# EAGLE schematic eagle_schematic (EAGLE 8.0.1)
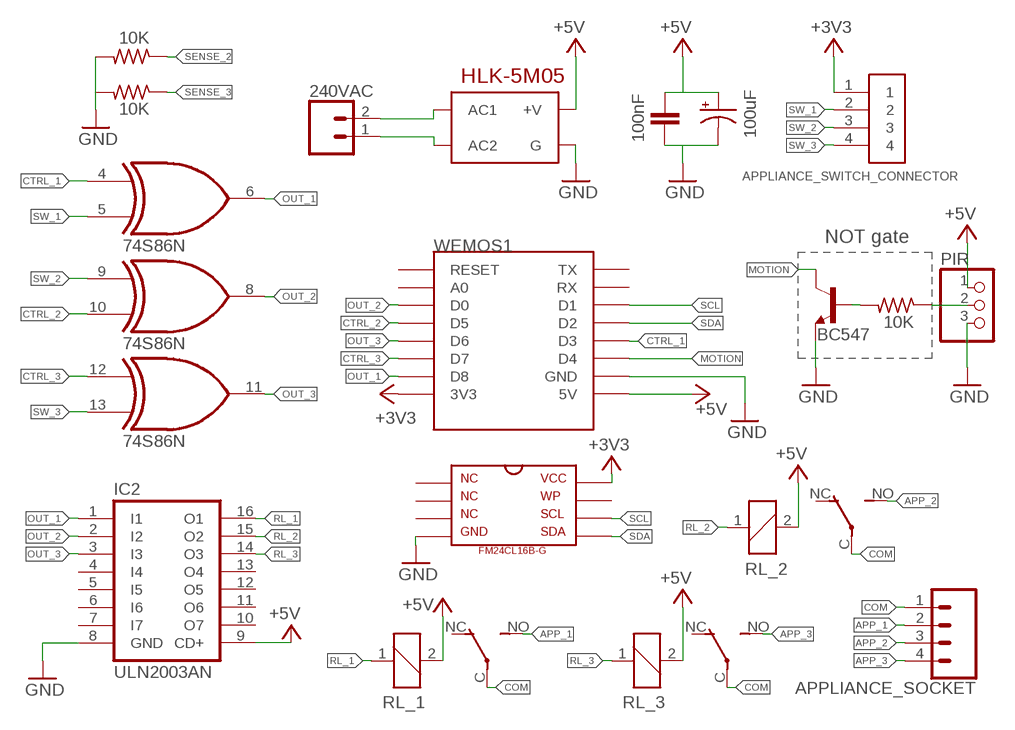
[diagram p0: schematic, sheet 1]

## Parts
240VAC  CONN_025MM  [SCREWTERMINAL-5MM-2]
APPLIANCE_SOCKET  CONN_04SCREW_LOCK  [SCREWTERMINAL-3.5MM-4_LOCK]
APPLIANCE_SWITCH_CONNECTOR  1X4-BIG  [1X04-BIG]
C1  100nF  C5/2.5  [C5B2.5]
C2  100uF  CPOL-USB45181B  [B45181B]
IC1  74S86N  [DIL14]
IC2  ULN2003AN  [DIL16]
PIR  PINHD-1X3CB  [1X03-CLEANBIG]
R1  10K  R-US_0204/7  [0204/7]
R2  10K  R-US_0204/7  [0204/7]
R3  10K  R-US_0204/7  [0204/7]
RL_1  CQ1-12V  [CQ1]
RL_2  CQ1-12V  [CQ1]
RL_3  CQ1-12V  [CQ1]
T1  BC547  [TO92]
U$1  HLK-5M05  [HLK-5M05]
U$3  FM24CL16B-G  [FM24CL16B-G]
WEMOS1  WEMOS-D1-MINI  [WEMOS-D1-MINI]

## Nets
+3V3: APPLIANCE_SWITCH_CONNECTOR.1 U$3.8 WEMOS1.3V3
+5V: C1.1 C2.+ IC2.9(CD+) PIR.1 RL_1.2 RL_2.2 RL_3.2 U$1.+V WEMOS1.5V
APP_1: APPLIANCE_SOCKET.2 RL_1.NO(2:S)
APP_2: APPLIANCE_SOCKET.3 RL_2.NO(2:S)
APP_3: APPLIANCE_SOCKET.4 RL_3.NO(2:S)
COM: APPLIANCE_SOCKET.1 RL_1.C(2:P) RL_2.C(2:P) RL_3.C(2:P)
CTRL_1: IC1.4(B:I0) WEMOS1.D3
CTRL_2: IC1.10(C:I1) WEMOS1.D5
CTRL_3: IC1.12(D:I0) WEMOS1.D7
GND: C1.2 C2.- IC2.8(GND) PIR.3 R2.2 R3.2 T1.1(E) U$1.G U$3.4 WEMOS1.GND
MOTION: T1.3(C) WEMOS1.D4
N$1: R1.2 T1.2(B)
N$2: PIR.2 R1.1
N$3: 240VAC.2 U$1.AC1
N$4: 240VAC.1 U$1.AC2
OUT_1: IC1.6(B:O) IC2.1(I1) WEMOS1.D8
OUT_2: IC1.8(C:O) IC2.2(I2) WEMOS1.D0
OUT_3: IC1.11(D:O) IC2.3(I3) WEMOS1.D6
RL_1: IC2.16(O1) RL_1.1
RL_2: IC2.15(O2) RL_2.1
RL_3: IC2.14(O3) RL_3.1
SCL: U$3.6 WEMOS1.D1
SDA: U$3.5 WEMOS1.D2
SENSE_2: R2.1
SENSE_3: R3.1
SW_1: APPLIANCE_SWITCH_CONNECTOR.2 IC1.5(B:I1)
SW_2: APPLIANCE_SWITCH_CONNECTOR.3 IC1.9(C:I0)
SW_3: APPLIANCE_SWITCH_CONNECTOR.4 IC1.13(D:I1)
Unconnected: IC1.1(A:I0) IC1.2(A:I1) IC1.3(A:O) IC2.4(I4) IC2.5(I5) IC2.6(I6) IC2.7(I7) IC2.10(O7) IC2.11(O6) IC2.12(O5) IC2.13(O4) RL_1.NC(2:O) RL_2.NC(2:O) RL_3.NC(2:O) U$3.1 U$3.2 U$3.3 U$3.7 WEMOS1.A0 WEMOS1.RESET WEMOS1.RX WEMOS1.TX

## Notes on the sheet
- NOT gate

## Power pins joined to a net without a drawn wire
GND: IC1.7(P:GND)
VCC: IC1.14(P:VCC)

## Library data of the parts
240VAC = SparkFun-Retired:CONN_02: Multi connection point. Often used as Generic Header-pin footprint for 0.1 inch spaced/style header connections On any of the 0.1 inch spaced packages, you can populate with these: Break Away Headers - Straight <https://www.sparkfun.com/products/116> (PRT-00116) Break Away Male Headers - Right Angle <https://www.sparkfun.com/products/553> (PRT-00553) Female Headers <https://www.sparkfun.com/products/115> (PRT-00115) Break Away Headers - Machine Pin <https://www.sparkfun.com/products/117> (PRT-00117) Break Away Female Headers - Swiss Machine Pin <https://www.sparkfun.com/products/743> (PRT-00743) For SCREWTERMINALS and SPRING TERMINALS visit here: Screw Terimnals on SparkFun.com <https://www.sparkfun.com/search/results?term=Screw+Terminals> (5mm/3.5mm/2.54mm spacing) This device is also useful as a general connection point to wire up your design to another part of your project. Our various solder wires solder well into these plated through hole pads. Hook-Up Wire - Assortment (Stranded, 22 AWG) <https://www.sparkfun.com/products/11375> (PRT-11375) Hook-Up Wire - Assortment (Solid Core, 22 AWG) <https://www.sparkfun.com/products/11367> (PRT-11367) View the entire wire category on our website here <https://www.sparkfun.com/categories/141> Special notes: Molex polarized connector foot print use with: PRT-08233 with associated crimp pins and housings. 2.54_SCREWTERM for use with PRT-10571. 3.5mm Screw Terminal footprints for PRT-08084 5mm Screw Terminal footprints for use with PRT-08432; SF_SKU: PRT-08432
APPLIANCE_SOCKET = SparkFun-Connectors:CONN_04: Multi connection point. Often used as Generic Header-pin footprint for 0.1 inch spaced/style header connections On any of the 0.1 inch spaced packages, you can populate with these: Break Away Headers - Straight <https://www.sparkfun.com/products/116> (PRT-00116) Break Away Male Headers - Right Angle <https://www.sparkfun.com/products/553> (PRT-00553) Female Headers <https://www.sparkfun.com/products/115> (PRT-00115) Break Away Headers - Machine Pin <https://www.sparkfun.com/products/117> (PRT-00117) Break Away Female Headers - Swiss Machine Pin <https://www.sparkfun.com/products/743> (PRT-00743) For SCREWTERMINALS and SPRING TERMINALS visit here: Screw Terimnals on SparkFun.com <https://www.sparkfun.com/search/results?term=Screw+Terminals> (5mm/3.5mm/2.54mm spacing) This device is also useful as a general connection point to wire up your design to another part of your project. Our various solder wires solder well into these plated through hole pads. Hook-Up Wire - Assortment (Stranded, 22 AWG) <https://www.sparkfun.com/products/11375> (PRT-11375) Hook-Up Wire - Assortment (Solid Core, 22 AWG) <https://www.sparkfun.com/products/11367> (PRT-11367) View the entire wire category on our website here <https://www.sparkfun.com/categories/141> Special notes: Molex polarized connector foot print use with SKU : PRT-08231 with associated crimp pins and housings. 1MM SMD Version SKU: PRT-10208
APPLIANCE_SWITCH_CONNECTOR = adafruit:1X4: 4-pin connector
C1 = capacitor-wima:C: CAPACITOR naming: grid - package width
C2 = adafruit:CPOL-US: POLARIZED CAPACITOR, American symbol
IC1 = 74xx-us:74*86: Quad 2-input EXCLUSIV-OR (XOR) gate
IC2 = uln-udn:ULN2003A: DRIVER ARRAY
PIR = adafruit:PINHD-1X3: PIN HEADER
R1-R3 = adafruit:R-US_: RESISTOR, American symbol
RL_1-RL_3 = relay:CQ1-12V: AUTOMOTIVE QUIET RELAY NAiS Source: http://www.mew-europe.com/.. en_ds_61208_0000.pdf; OC_FARNELL: unknown; OC_NEWARK: unknown
T1 = transistor:BC547: NPN TRANSISTOR
U$1 = HLK-5M05:HLK-5M05
U$3 = FM24CL16B-G_fram:FM24CL16B-G: 16-Kbit (2K × 8) Serial (I2C) F-RAM
WEMOS1 = esp8266:WEMOS-D1-MINI: WeMos.cc D1 mini ESP8266 module